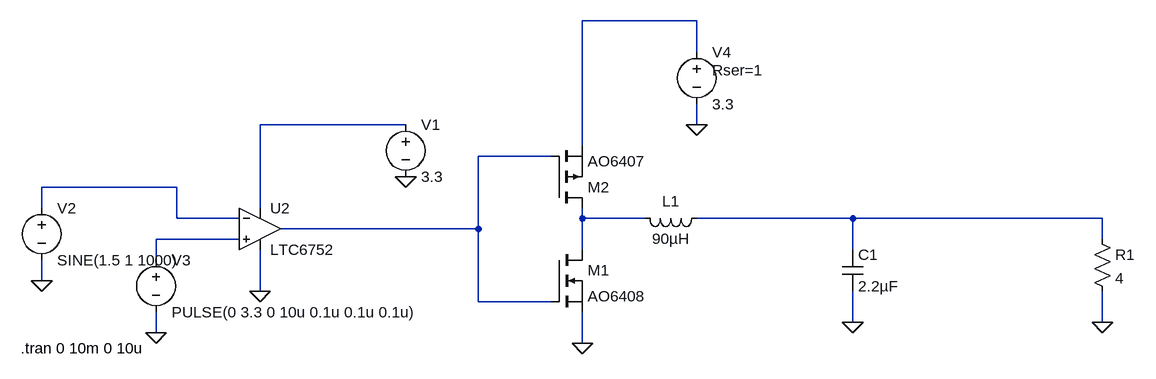
[diagram p0: schematic pwm__classD_amp.asc]
pwm__classD_amp.asc, the LTspice schematic file:
Version 4
SHEET 1 1480 680
WIRE 800 -176 624 -176
WIRE 800 -128 800 -176
WIRE 352 -16 128 -16
WIRE 800 -16 800 -48
WIRE 624 16 624 -176
WIRE 576 32 464 32
WIRE 0 80 -208 80
WIRE -208 112 -208 80
WIRE 128 112 128 -16
WIRE 0 128 0 80
WIRE 96 128 0 128
WIRE 624 128 624 112
WIRE 720 128 624 128
WIRE 1040 128 800 128
WIRE 1424 128 1040 128
WIRE 464 144 464 32
WIRE 464 144 160 144
WIRE 96 160 -32 160
WIRE 1424 160 1424 128
WIRE 624 176 624 128
WIRE 1040 176 1040 128
WIRE -32 192 -32 160
WIRE -208 224 -208 192
WIRE 128 240 128 176
WIRE 464 256 464 144
WIRE 576 256 464 256
WIRE 1040 288 1040 240
WIRE 1424 288 1424 240
WIRE -32 304 -32 272
WIRE 624 320 624 272
FLAG 128 240 0
FLAG 352 64 0
FLAG -32 304 0
FLAG -208 224 0
FLAG 800 -16 0
FLAG 624 320 0
FLAG 1424 288 0
FLAG 1040 288 0
SYMBOL voltage 352 -32 R0
WINDOW 123 0 0 Left 2
WINDOW 39 0 0 Left 2
SYMATTR InstName V1
SYMATTR Value 3.3
SYMBOL voltage -208 96 R0
WINDOW 123 0 0 Left 2
WINDOW 39 0 0 Left 2
SYMATTR InstName V2
SYMATTR Value SINE(1.5 1 1000)
SYMBOL voltage -32 176 R0
WINDOW 123 0 0 Left 2
WINDOW 39 0 0 Left 2
SYMATTR InstName V3
SYMATTR Value PULSE(0 3.3 0 10u 0.1u 0.1u 0.1u)
SYMBOL Comparators\\LTC6752 128 80 R0
SYMATTR InstName U2
SYMBOL nmos 576 176 R0
SYMATTR InstName M1
SYMATTR Value AO6408
SYMBOL pmos 576 112 M180
SYMATTR InstName M2
SYMATTR Value AO6407
SYMBOL voltage 800 -144 R0
WINDOW 123 0 0 Left 2
WINDOW 39 24 44 Left 2
SYMATTR SpiceLine Rser=1
SYMATTR InstName V4
SYMATTR Value 3.3
SYMBOL res 1408 144 R0
SYMATTR InstName R1
SYMATTR Value 4
SYMBOL ind 816 112 R90
WINDOW 0 5 56 VBottom 2
WINDOW 3 32 56 VTop 2
SYMATTR InstName L1
SYMATTR Value 90µH
SYMBOL cap 1024 176 R0
SYMATTR InstName C1
SYMATTR Value 2.2µF
TEXT -240 328 Left 2 !.tran 0 10m 0 10u

The netlist it stands for:
* pwm__classD_amp.asc
V1 N002 0 3.3
V2 N004 0 SINE(1.5 1 1000)
V3 N007 0 PULSE(0 3.3 0 10u 0.1u 0.1u 0.1u)
XU2 N007 N004 N002 0 N003 LTC6752  ; pins In+ In- V+ V- OUT
M1 N005 N003 0 0 AO6408
M2 N005 N003 N001 N001 AO6407
V4 N001 0 3.3 Rser=1
R1 N006 0 4
L1 N006 N005 90µH
C1 N006 0 2.2µF
.model NMOS NMOS
.model PMOS PMOS
.lib standard.mos
.tran 0 10m 0 10u
.lib LTC7.lib
.backanno
.end